# EAGLE schematic MidiInterface (EAGLE 9.5.2)
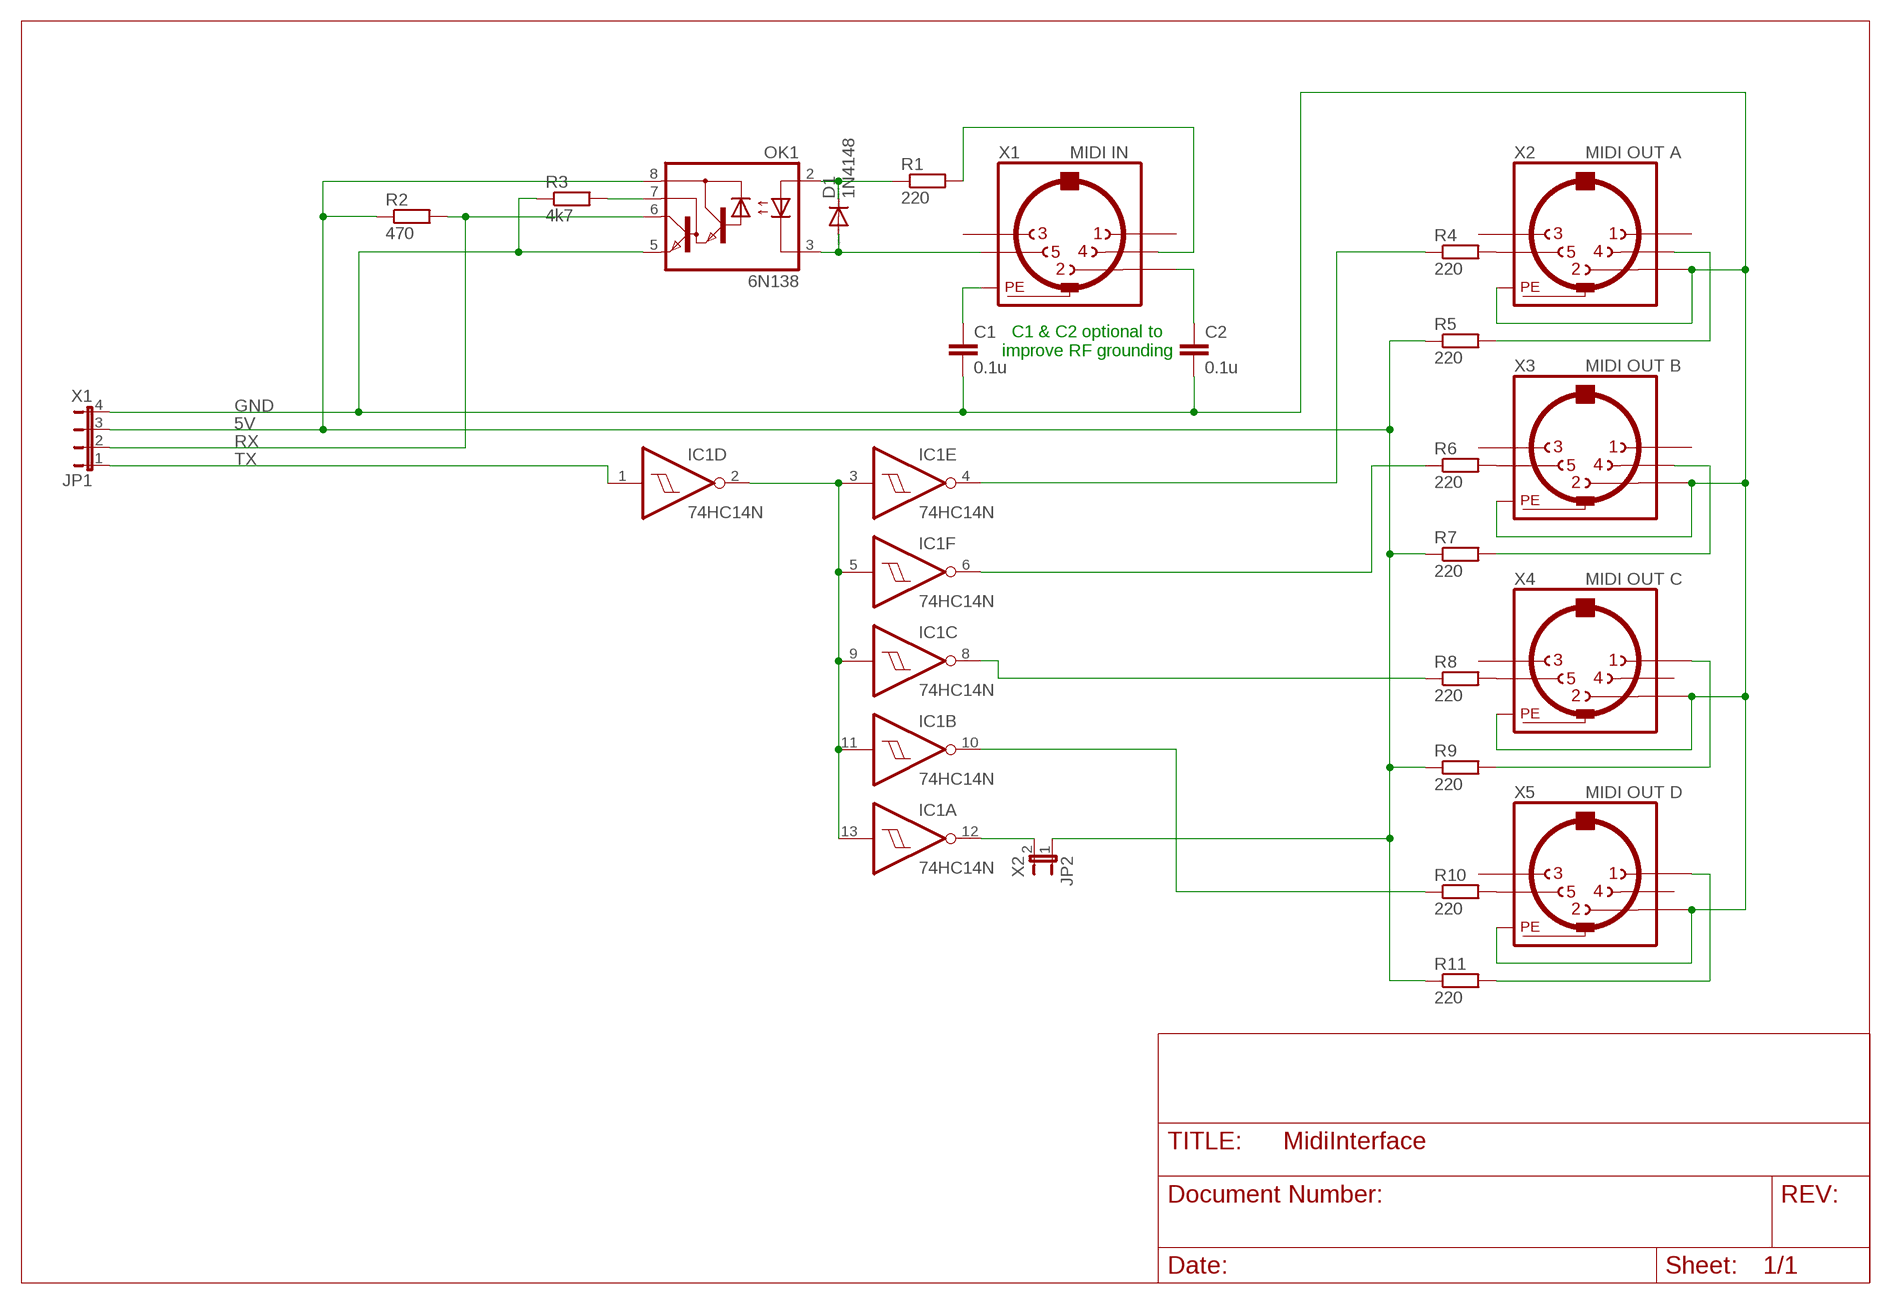
[diagram p0: schematic, sheet 1]

## Parts
C1  0.1u  C-EU025-025X050  [C025-025X050]
C2  0.1u  C-EU025-025X050  [C025-025X050]
D1  1N4148  1N4148DO35-7  [DO35-7]
IC1  74HC14N  [DIL14]
JP1  X1  JP4E  [JP4]
JP2  X2  JP1E  [JP1]
OK1  6N138  [DIL08]
R1  220  R-EU_0204/7  [0204/7]
R2  470  R-EU_0204/7  [0204/7]
R3  4k7  R-EU_0204/7  [0204/7]
R4  220  R-EU_0204/7  [0204/7]
R5  220  R-EU_0204/7  [0204/7]
R6  220  R-EU_0204/7  [0204/7]
R7  220  R-EU_0204/7  [0204/7]
R8  220  R-EU_0204/7  [0204/7]
R9  220  R-EU_0204/7  [0204/7]
R10  220  R-EU_0204/7  [0204/7]
R11  220  R-EU_0204/7  [0204/7]
X1  MIDI IN  MAB5SH  [MAB5SH]
X2  MIDI OUT A  MAB5SH  [MAB5SH]
X3  MIDI OUT B  MAB5SH  [MAB5SH]
X4  MIDI OUT C  MAB5SH  [MAB5SH]
X5  MIDI OUT D  MAB5SH  [MAB5SH]

## Nets
5V: JP1.3 JP2.1 OK1.8(VCC) R2.1 R5.1 R7.1 R9.1 R11.1
GND: C1.2 C2.2 JP1.4 OK1.5(GND) R3.1 X2.2 X2.PE X2.PE@(PE) X3.2 X3.PE X3.PE@(PE) X4.2 X4.PE X4.PE@(PE) X5.2 X5.PE X5.PE@(PE)
N$1: R1.2 X1.4
N$2: D1.C OK1.2(A) R1.1
N$3: D1.A OK1.3(C) X1.5
N$4: OK1.7(VB) R3.2
N$5: R4.2 X2.5
N$6: R6.2 X3.5
N$7: R8.2 X4.5
N$8: R10.2 X5.5
N$9: R5.2 X2.4
N$10: R7.2 X3.4
N$11: R9.2 X4.1
N$12: R11.2 X5.1
N$13: IC1.2(D:O) IC1.3(E:I) IC1.5(F:I) IC1.9(C:I) IC1.11(B:I) IC1.13(A:I)
N$14: IC1.4(E:O) R4.1
N$15: IC1.6(F:O) R6.1
N$16: IC1.8(C:O) R8.1
N$17: IC1.10(B:O) R10.1
N$18: IC1.12(A:O) JP2.2
N$19: C1.1 X1.PE X1.PE@(PE)
N$20: C2.1 X1.2
RX: JP1.2 OK1.6(VO) R2.2
TX: IC1.1(D:I) JP1.1
Unconnected: X1.1 X1.3 X2.1 X2.3 X3.1 X3.3 X4.3 X4.4 X5.3 X5.4

## Notes on the sheet
- C1 & C2 optional to
  improve RF grounding

## Power pins joined to a net without a drawn wire
GND: IC1.7(P:GND)
VCC: IC1.14(P:VCC)

## Library data of the parts
C1 C2 = rcl:C-EU: CAPACITOR, European symbol; SPICEPREFIX: C
D1 = diode:1N4148: DIODE high speed (Philips)
IC1 = 74xx-eu:74*14: Hex schmitt trigger INVERTER
JP1 = jumper:JP4E: JUMPER
JP2 = jumper:JP1E: JUMPER
OK1 = optocoupler:6N138: MOTOROLA OPTO COUPLER; MF: VISHAY/TELEFUNKEN; MPN: 6N138; OC_FARNELL: 9860150; OC_NEWARK: 35K5294
R1-R11 = rcl:R-EU_: RESISTOR, European symbol
X1-X5 = con-hirschmann:MAB5SH: Female CONNECTOR 5 pins 90 deg. with shield, horizontal (DIN 41524); OC_FARNELL: 809883; OC_NEWARK: unknown